# EAGLE design pedometer_x1 (EAGLE 9.6.2)
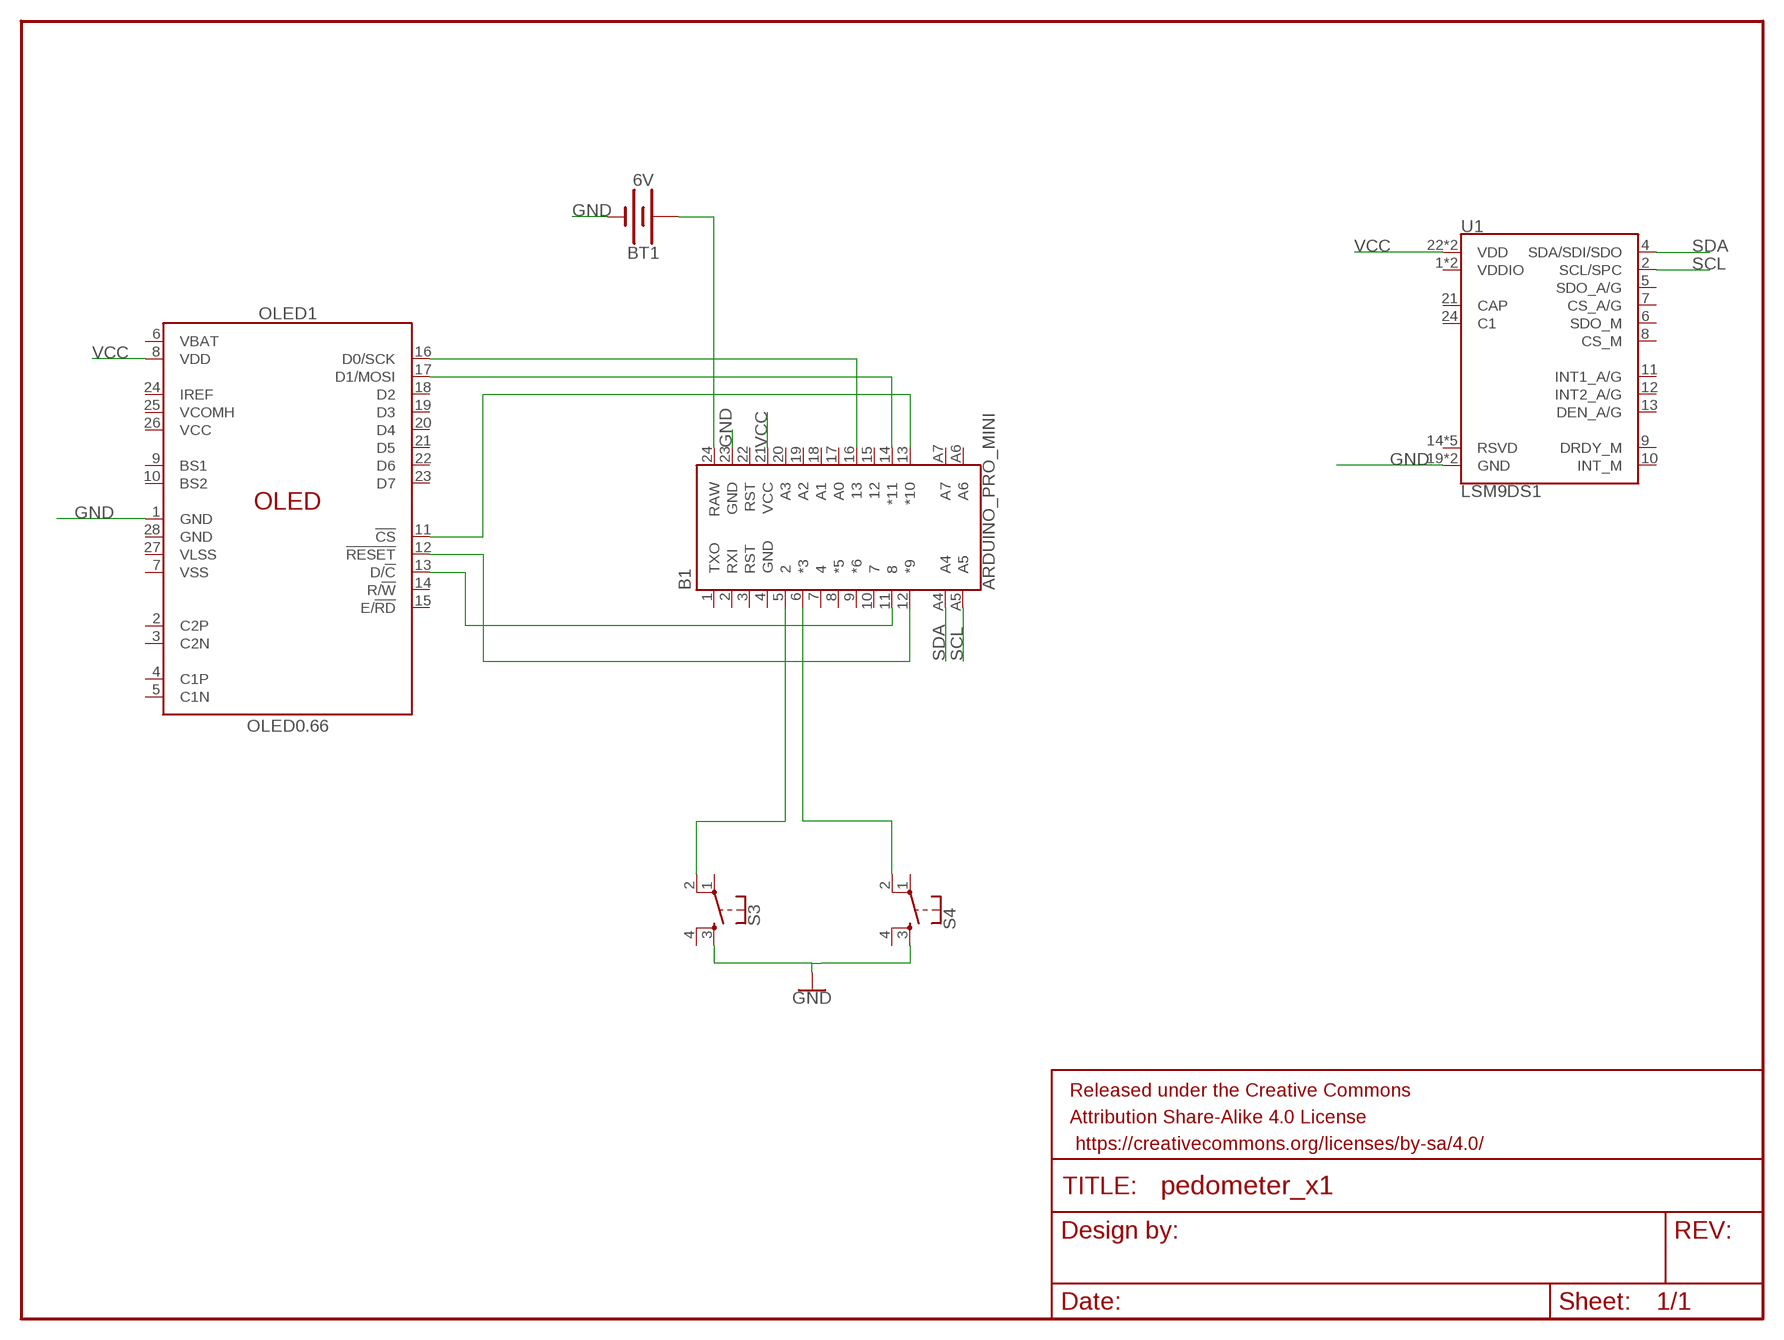
[diagram p0: schematic, sheet 1]

## Parts
B1  ARDUINO_PRO_MINI  [ARDUINO_PRO_MINI]
BT1  6V  BATTERY-20MM_PTH_KIT  [BATTCOM_20MM_PTH_KIT]
FRAME1  FRAME-LETTER  [CREATIVE_COMMONS]
OLED1  OLED0.66  [OLED-0.66-64X48]
S3  TAC_SWITCHPTH  [TACTILE-PTH]
S4  TAC_SWITCHPTH  [TACTILE-PTH]
U1  LSM9DS1  [LGA-24-3.5X3]

## Nets
GND: B1.23(GND) BT1.2(-) OLED1.1(GND) S3.3 S4.3 U1.19(GND) U1.20(GND)
N$2: B1.5 S3.2
N$3: B1.6(*3) S4.2
N$5: B1.24(RAW) BT1.1(+)
N$6: B1.16 OLED1.16(D0/SCK)
N$7: B1.13(*10) OLED1.11(!CS!)
N$8: B1.12(*9) OLED1.12(!RESET!)
N$9: B1.14(*11) OLED1.17(D1/MOSI)
N$10: B1.11 OLED1.13(D/!C!)
SCL: B1.A5 U1.2(SCL/SPC)
SDA: B1.A4 U1.4(SDA/SDI/SDO)
VCC: B1.21(VCC) OLED1.8(VDD) U1.22(VDD) U1.23(VDD)
Unconnected: B1.1(TXO) B1.2(RXI) B1.3(RST) B1.7 B1.8(*5) B1.9(*6) B1.10 B1.15 B1.17(A0) B1.18(A1) B1.19(A2) B1.20(A3) B1.22(RST) B1.A6 B1.A7 OLED1.2(C2P) OLED1.3(C2N) OLED1.4(C1P) OLED1.5(C1N) OLED1.6(VBAT) OLED1.7(VSS) OLED1.9(BS1) OLED1.10(BS2) OLED1.14(R/!W!) OLED1.15(E/!RD!) OLED1.18(D2) OLED1.19(D3) OLED1.20(D4) OLED1.21(D5) OLED1.22(D6) OLED1.23(D7) OLED1.24(IREF) OLED1.25(VCOMH) OLED1.26(VCC) OLED1.27(VLSS) OLED1.28(GND) S3.1 S3.4 S4.1 S4.4 U1.1(VDDIO) U1.3(VDDIO) U1.5(SDO_A/G) U1.6(SDO_M) U1.7(CS_A/G) U1.8(CS_M) U1.9(DRDY_M) U1.10(INT_M) U1.11(INT1_A/G) U1.12(INT2_A/G) U1.13(DEN_A/G) U1.14(RSVD) U1.15(RSVD) U1.16(RSVD) U1.17(RSVD) U1.18(RSVD) U1.21(CAP) U1.24(C1)

## Power pins joined to a net without a drawn wire
GND: B1.4(GND)

## Library data of the parts
B1 = SparkFun-Boards:ARDUINO_PRO_MINI: SparkFun Pro Mini Pro Mini compatible footprint. Dimensions: 0.7 x 1.3" PCB Thickness: 0.8mm SparkFun Products: 3.3V/8MHz <https://www.sparkfun.com/products/11114> 5V/16MHz <https://www.sparkfun.com/products/11113>
BT1 = SparkFun-Batteries:BATTERY: Battery - Single Cell A variety of battery chemistries, sizes, and footprints. Device List: 20MM_PTH - Coin Cell Battery Holder - 20mm (PTH) <https://www.sparkfun.com/products/783> 20MM_PTH_KIT- Coin Cell battery Holder - 20 mm (PTH) <http://www.sparkfun.com/products/783>kit version with special mask 6.8MM_PTH - Coin Cell Battery Holder - 6.8MM(SMD) <https://www.digikey.com/product-detail/en/seiko-instruments/MS621FE-FL11E/728-1057-ND/1889208?WT.srch=1&gclid=CNOQ5a6LzdQCFZS2wAodXCkE0g> 12MM_SMD - Coin Cell Battery Holder - 12mm (SMD) <https://www.sparkfun.com/products/10592> 12MM_PTH - Coin Cell Battery Holder - 12mm (PTH) <https://www.sparkfun.com/products/7948> 20MM_SMD - 20mm Coin Cell Battery Holder (SMD) (2 legs) Used on the Big Time Watch Kit <https://www.sparkfun.com/products/11734> 20MM_SMD_4LEGS - Coin Cell Battery Holder - 20mm (SMD) <https://www.sparkfun.com/products/11892> 20MM_SMD_4LEGS_OVERPASTE - Coin Cell Battery Holder - 20mm (SMD) <https://www.sparkfun.com/products/11892> (Over-paste on the legs) 24.5MM_PTH - Coin Cell Battery Holder - 24.5mm (PTH) <https://www.sparkfun.com/products/8863> 9V - 9V Battery Holder - PC Mount Used on the SparkFun SparkPunk Sound Kit <https://www.sparkfun.com/products/11177> and SparkFun SparkPunk Sequencer Kit <https://www.sparkfun.com/products/12707> 18650 - Battery Holder - 18650 (PTH) <https://www.sparkfun.com/products/13113> AA - Battery Holder - 1xAA (PTH) <https://www.sparkfun.com/products/7949> AAA - Battery Holder - 1xAAA (PTH) <https://www.sparkfun.com/products/12718> AA_KIT - Battery Holder - 1xAA (PTH) <https://www.sparkfun.com/products/7949> Special kit package - pads only have exposed copper on one side of the board. AAA_KIT - Battery Holder - 1xAAA (PTH) <https://www.sparkfun.com/products/12718> Special kit package - pads only have exposed copper on one side of the board.
FRAME1 = SparkFun-Aesthetics:FRAME-LETTER: Schematic Frame - Letter Standard 8.5x11 US Letter frame
OLED1 = SparkFun-Displays:OLED0.66: Micro OLED TODO: Add description SparkFun Products: Micro OLED Breakout <https://www.sparkfun.com/products/13003>; PROD_ID: LCD-12019
S3 S4 = SparkFun-Retired:TAC_SWITCH: Momentary Switch Button commonly used for reset or general input. Spark Fun Electronics SKU : COM-00097 SMT- SWCH-08247
U1 = SparkFun-Sensors:LSM9DS1: ST Microelectronics LSM9DS1 9DOF IMU - Accelerometer, Gyroscope & Magnetometer The LSM9DS1 is a versatile, motion-sensing system-in-a-chip. It houses a 3-axis accelerometer, 3-axis gyroscope, and 3-axis magnetometer – nine degrees of freedom (9DOF) in a single IC! The LSM9DS1 is equipped with a digital interface, but even that is flexible: it supports both I2C and SPI, so you’ll be hard-pressed to find a microcontroller it doesn’t work with. Datasheet <https://cdn.sparkfun.com/assets/learn_tutorials/3/7/3/LSM9DS1_Datasheet.pdf> SparkFun Products SparkFun 9 Degrees of Freedom IMU Breakout - LSM9DS1 <https://www.sparkfun.com/products/13284> (SEN-13284) SparkFun Photon IMU Shield <https://www.sparkfun.com/products/13629> (DEV-13629); PROD_ID: IC-12536

## Board
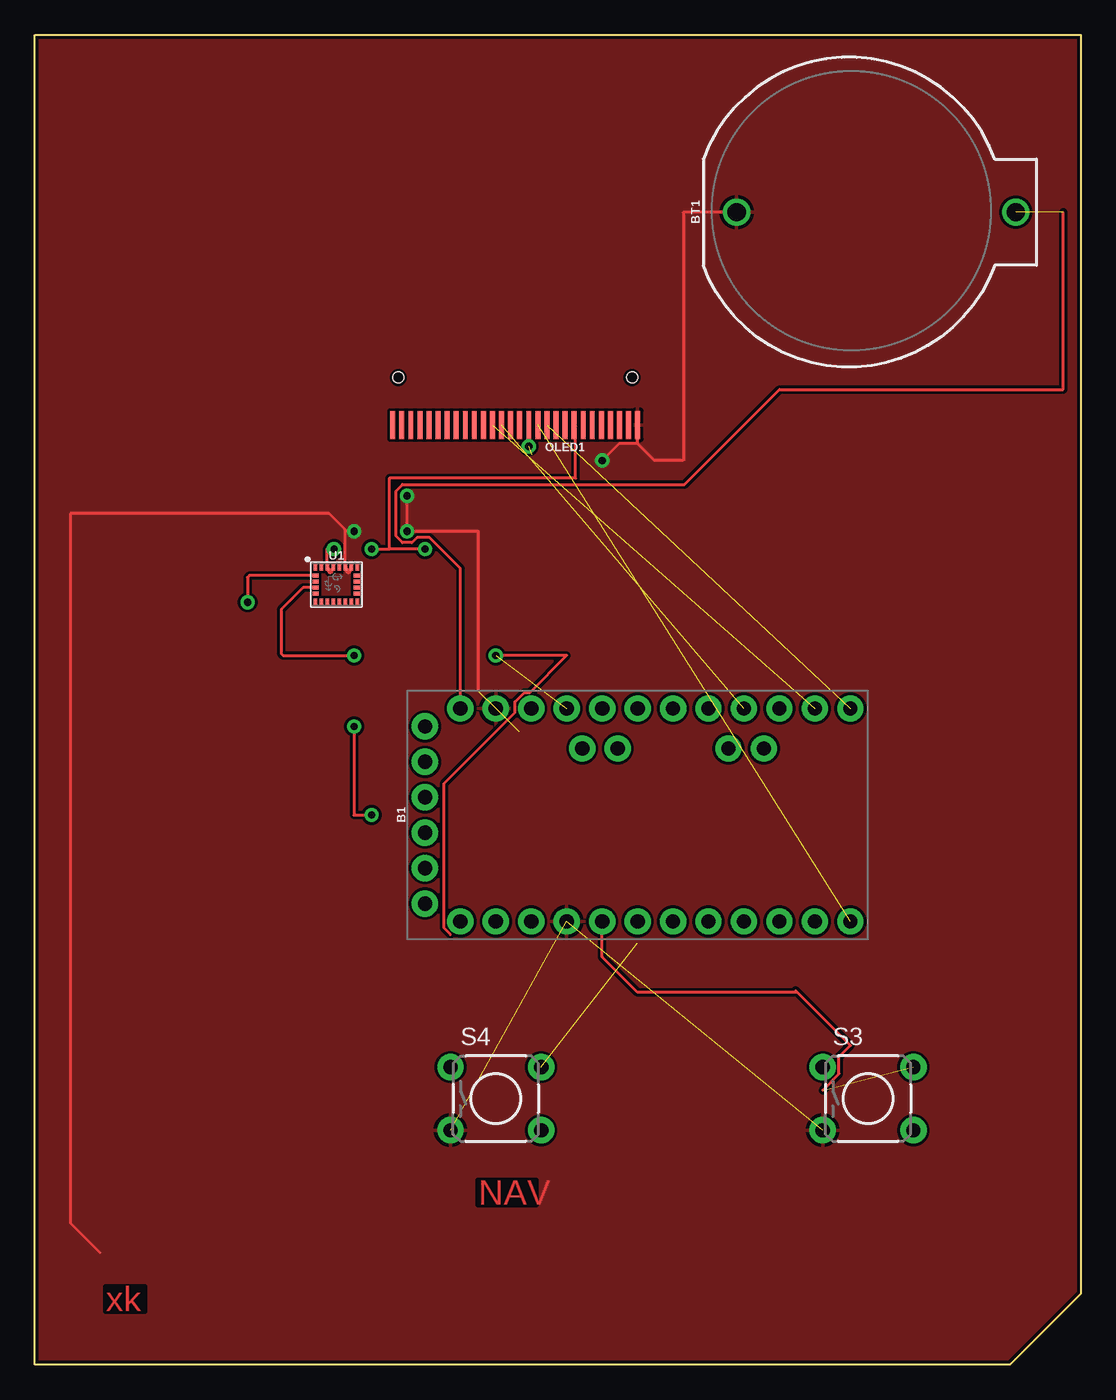
[diagram p1: board, top side]
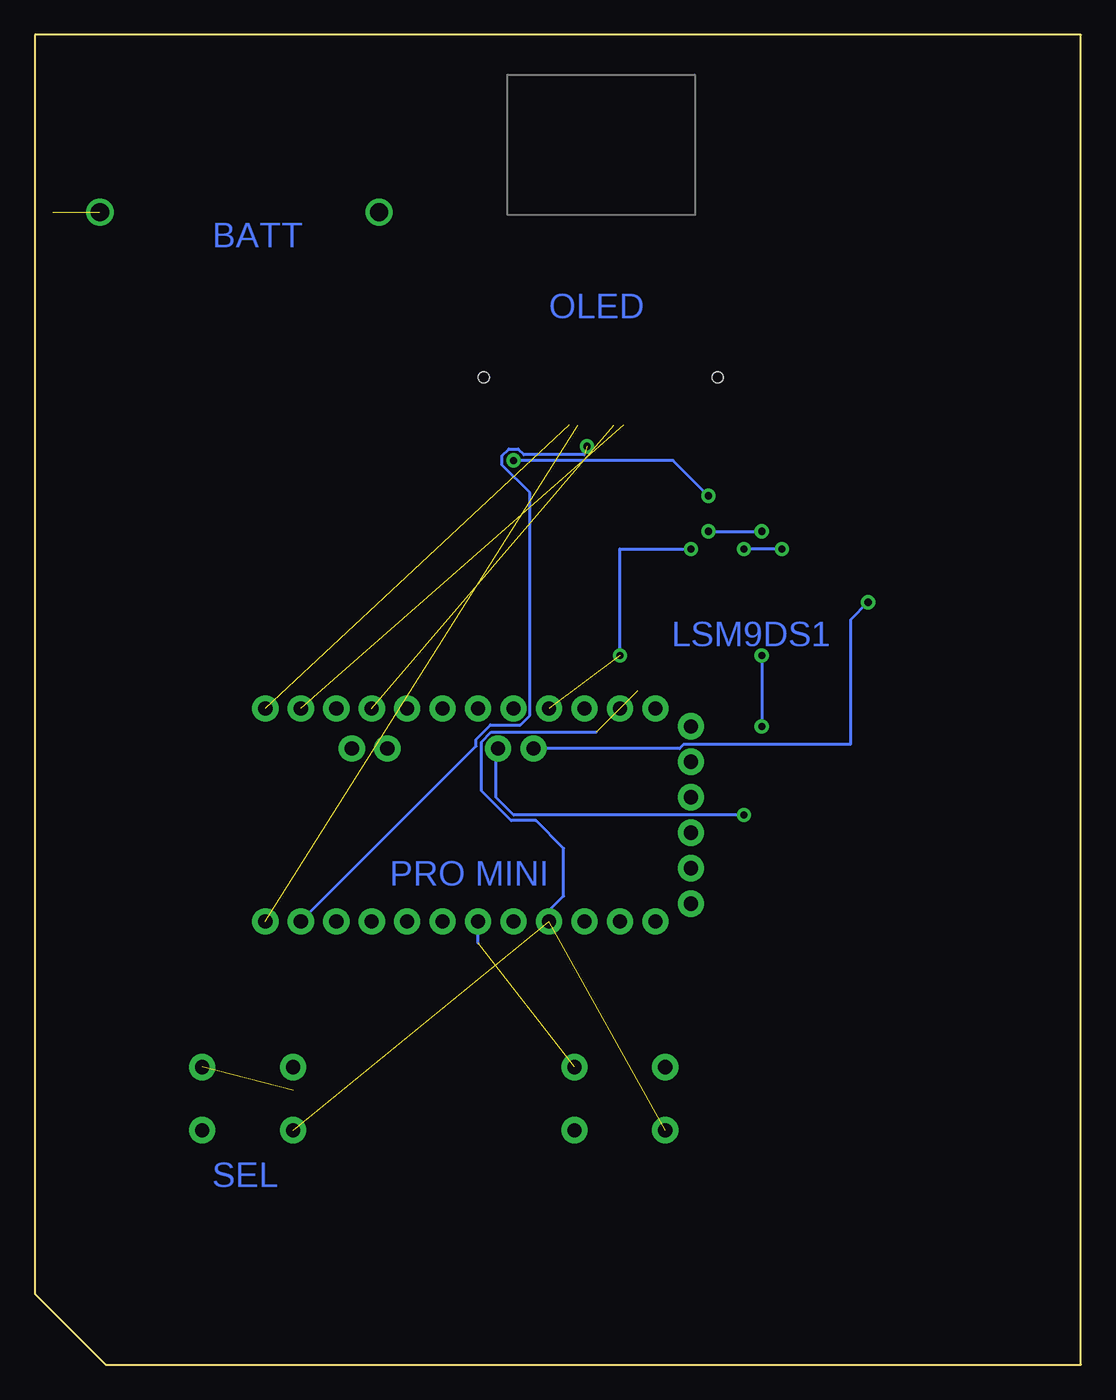
[diagram p2: board, bottom side, seen from below]

Size 74.93 x 95.25 mm. Coordinates in mm from the lower left corner, seen from the top.
Outline: 0,0 0,95.25 74.93,95.25 74.93,5.08 69.85,0 0,0
Copper layers (1*16): Top 0.035mm / dielectric 1.5mm / Bottom 0.035mm
Design rules "SparkFun *": minimum track width 8mil, minimum drill 20mil, track to track 8mil, track to pad 5mil, pad to pad 5mil, via to via 8mil, smd to smd 5mil, copper to edge 8mil, drill to drill 8mil, minimum pad ring 12mil, minimum via ring 10mil, stop-mask expansion 4mil, vias tented up to drill 20mil, thermal gap 10mil

### Footprints (pad centres in the part's own frame; a part is rotated, then mirrored left to right if it is on the bottom)
ARDUINO_PRO_MINI = drill 1.016 pad 1.88: 1 -7.62,12.7; 2 -7.62,10.16; 3 -7.62,7.62; 4 -7.62,5.08; 5 -7.62,2.54; 6 -7.62,0; 7 -7.62,-2.54; 8 -7.62,-5.08; 9 -7.62,-7.62; 10 -7.62,-10.16; 11 -7.62,-12.7; 12 -7.62,-15.24; 13 7.62,-15.24; 14 7.62,-12.7; 15 7.62,-10.16; 16 7.62,-7.62; 17 7.62,-5.08; 18 7.62,-2.54; 19 7.62,0; 20 7.62,2.54; 21 7.62,5.08; 22 7.62,7.62; 23 7.62,10.16; 24 7.62,12.7; A4 4.763,1.429; A5 4.763,3.969; A6 4.763,-9.049; A7 4.763,-6.509; BLK -6.35,15.24; GND -3.81,15.24; GRN 6.35,15.24; RXI 1.27,15.24; TXO 3.81,15.24; VCC -1.27,15.24
BATTCOM_20MM_PTH_KIT = drill 1.3: 1 11.85,0; 2 -8.15,0
OLED-0.66-64X48 = smd 0.35 x 2: 1 0,0; 2 0.65,0; 3 1.3,0; 4 1.95,0; 5 2.6,0; 6 3.25,0; 7 3.9,0; 8 4.55,0; 9 5.2,0; 10 5.85,0; 11 6.5,0; 12 7.15,0; 13 7.8,0; 14 8.45,0; 15 9.1,0; 16 9.75,0; 17 10.4,0; 18 11.05,0; 19 11.7,0; 20 12.35,0; 21 13,0; 22 13.65,0; 23 14.3,0; 24 14.95,0; 25 15.6,0; 26 16.25,0; 27 16.9,0; 28 17.55,0 | hole 0.8: 17.15,-3.4; 0.4,-3.4
TACTILE-PTH = drill 1.016 pad 1.88: 1 -3.251,2.261; 2 3.251,2.261; 3 -3.251,-2.261; 4 3.251,-2.261
LGA-24-3.5X3 = smd 0.27 x 0.45: 1 -1.505,1.225; 6 -1.505,-1.225; 7 -1.075,-1.225; 8 -0.645,-1.225; 9 -0.215,-1.225; 10 0.215,-1.225; 11 0.645,-1.225; 12 1.075,-1.225; 13 1.505,-1.225; 18 1.505,1.225; 19 1.075,1.225; 20 0.645,1.225; 21 0.215,1.225; 22 -0.215,1.225; 23 -0.645,1.225; 24 -1.075,1.225 | smd 0.45 x 0.27: 2 -1.475,0.645; 3 -1.475,0.215; 4 -1.475,-0.215; 5 -1.475,-0.645; 14 1.475,-0.645; 15 1.475,-0.215; 16 1.475,0.215; 17 1.475,0.645

### Placement (x,y rotation side)
B1  43.18,39.37 90 top
BT1  58.42,82.55 0 top
FRAME1  -67.31,59.69 0 top  (outside the outline)
OLED1  43.18,67.31 180 top
S3  59.69,19.05 0 top
S4  33.02,19.05 0 top
U1  21.59,55.88 0 top

### Tracks (layer width: path | path; a pad name or v marks a point on that pad's centre or on a via)
GND  (via drill 0.51 pad 0.55)  (4 unrouted)
  Top 0.203: 4.66,8.04 2.54,10.16 2.54,60.96 21.08,60.96 22.23,59.81 22.23,59.69 | 22.23,59.69 U1.20 22.32,57.02 22.32,56.83 22.4,56.75 22.5,56.75 22.58,56.83 22.58,57.02 U1.19 | 31.75,48.26 31.75,59.69 v26.67,59.69 v26.67,62.23 | v22.86,59.69 22.23,59.69 | v40.64,64.77 41.88,66 43.14,66 | 43.14,66 43.18,66.04 OLED1.1 | BT1.2 46.46,82.55 46.46,64.77 44.38,64.77 43.14,66
  Bottom 0.203: v26.67,59.69 v22.86,59.69 | v26.67,62.23 29.21,64.77 v40.64,64.77 | B1.4 38.1,32.52 37.05,33.57 37.05,36.98 39.03,38.96 40.81,38.96 42.92,41.08 42.92,44.62 42.23,45.3 34.71,45.3
  pour Top (isolate 0): 0,95.25 74.93,95.25 74.93,5.08 72.39,2.54 69.85,0 68.58,0 0,0
N$2  (1 unrouted)
  Top 0.203: 56.44,19.66 57.61,20.83 57.61,22.05 58.42,22.86 54.61,26.67 | 54.61,26.67 54.48,26.8 | 54.61,26.67 43.18,26.67 40.64,29.21 B1.5
N$3  (1 unrouted)
  Bottom 0.203: 43.18,30.2 B1.6
N$5  (1 unrouted)
  Top 0.203: B1.24 30.48,57.03 28.28,59.23 27.36,59.23 27.01,58.88 26.33,58.88 25.86,59.35 25.86,62.57 26.33,63.04 46.53,63.04 53.34,69.85 73.66,69.85 73.66,82.55
N$6  (1 unrouted)
N$7  (1 unrouted)
N$8  (1 unrouted)
N$9  (1 unrouted)
N$10  (via drill 0.51)  (1 unrouted)
  Top 0.203: OLED1.13 v35.38,65.78
  Bottom 0.203: B1.11 43.33,44.3 43.33,44.78 42.29,45.82 40.16,45.82 39.47,46.51 39.47,62.45 41.45,64.43 41.45,65.11 40.98,65.58 40.3,65.58 39.9,65.18 35.56,65.18
SCL  (via drill 0.51 pad 0.55)
  Top 0.203: U1.2 15.38,56.52 15.24,56.39 v15.24,54.61
  Bottom 0.203: v15.24,54.61 16.51,53.34 16.51,44.45 16.54,44.42 28.46,44.42 28.75,44.13 B1.A5
SDA  (via drill 0.51 pad 0.55)
  Top 0.203: v22.86,50.8 17.78,50.8 17.65,50.93 17.65,54.1 19.22,55.66 U1.4 | v22.86,45.72 22.86,39.37 v24.13,39.37
  Bottom 0.203: v22.86,50.8 v22.86,45.72 | v24.13,39.37 40.64,39.37 41.91,40.64 41.91,43.97 B1.A4
VCC  (via drill 0.51 pad 0.55)  (1 unrouted)
  Top 0.203: OLED1.8 38.73,67.2 38.73,63.5 25.4,63.5 25.4,58.42 | v21.42,58.42 20.95,58.42 20.95,58.41 U1.23 21.03,57.02 21.03,56.83 21.11,56.75 21.21,56.75 21.29,56.83 21.29,57.02 U1.22 | v24.13,58.42 25.4,58.42 | v27.94,58.42 25.4,58.42 | v33.02,50.8 38.1,50.8 35.46,48.16 35.08,48.16 34.39,47.47 34.39,46.71 29.31,41.63 29.31,31.27 29.77,30.81
  Bottom 0.203: v21.42,58.42 v24.13,58.42 | v33.02,50.8 33.02,58.42 v27.94,58.42

### Text on the board
Top: NAV | xk
Bottom: BATT | OLED | LSM9DS1 | PRO MINI | SEL